# EasyEDA schematic SCH_New-Project-123_2026-03-22.json
TITLE: Sheet_1; REV: 1.0; Date: 2026-03-16; Sheet: 1/1; Drawn By: shyamsunder2009pc; Company: Your Company
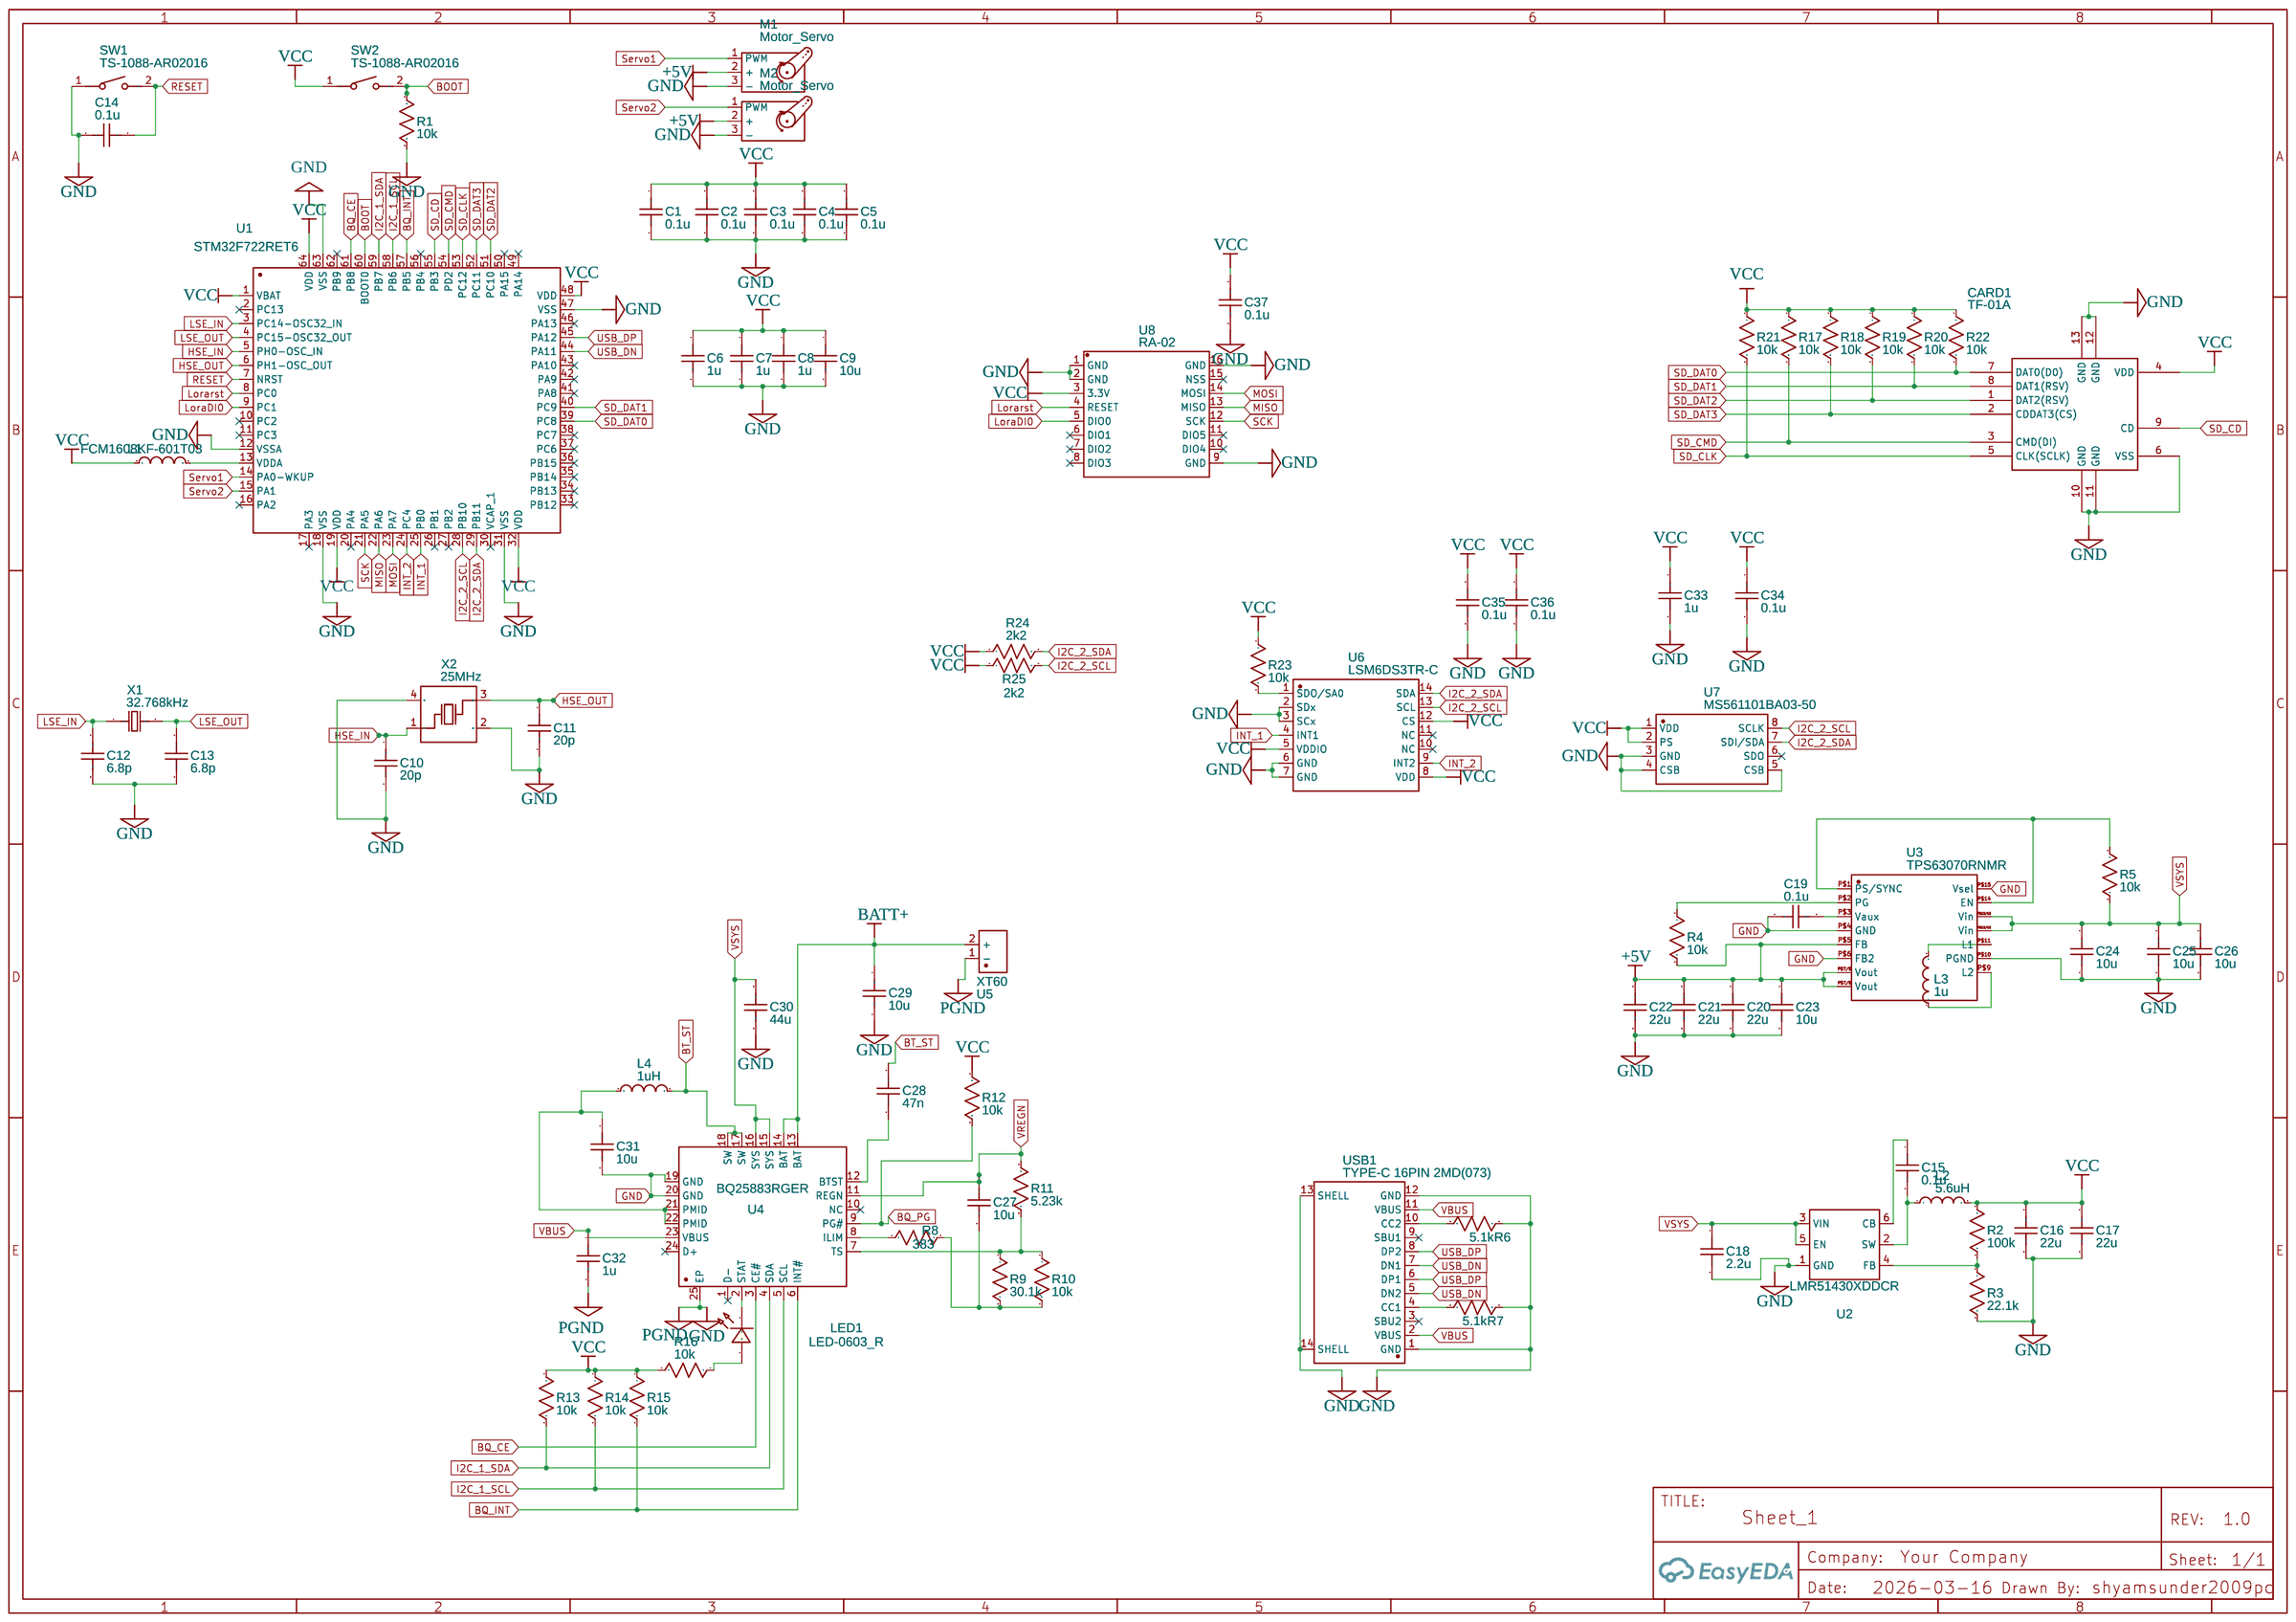
[diagram p0: schematic sheet]

## Parts
C1  0.1u  [C0603]
C2  0.1u  [C0603]
C3  0.1u  [C0603]
C4  0.1u  [C0603]
C5  0.1u  [C0603]
C6  1u  [C0603]
C7  1u  [C0603]
C8  1u  [C0603]
C9  10u  [C0805]
C10  20p  [C0603]
C11  20p  [C0603]
C12  6.8p  [C0603]
C13  6.8p  [C0603]
C14  0.1u  [C0603]
C15  0.1u  [C0603]
C16  22u  [C0805]
C17  22u  [C0805]
C18  2.2u  [C0603]
C19  0.1u  [C0603]
C20  22u  [C0805]
C21  22u  [C0805]
C22  22u  [C0805]
C23  10u  [C0805]
C24  10u  [C0805]
C25  10u  [C0805]
C26  10u  [C0805]
C27  10u  [C0805]
C28  47n  [C0603]
C29  10u  [C0805]
C30  44u  [C0805]
C31  10u  [C0805]
C32  1u  [C0603]
C33  1u  [C0603]
C34  0.1u  [C0603]
C35  0.1u  [C0603]
C36  0.1u  [C0603]
C37  0.1u  [C0603]
CARD1  TF-01A  [TF-SMD_TF-01A]
L1  FCM1608KF-601T03  [L0603]
L2  5.6uH  [IND-SMD_L3.0-W3.0]
L3  1u  [L0603]
L4  1uH  [L2520]
LED1  LED-0603_R  [LED0603_RED]
M1  Motor_Servo  [HDR-TH_PZ254V-11-03P-YL]
M2  Motor_Servo  [HDR-TH_PZ254V-11-03P-YL]
R1  10k  [R0603]
R2  100k  [R0603]
R3  22.1k  [R0603]
R4  10k  [R0603]
R5  10k  [R0603]
R6  5.1k  [R0603]
R7  5.1k  [R0603]
R8  383  [R0603]
R9  30.1k  [R0603]
R10  10k  [R0603]
R11  5.23k  [R0603]
R12  10k  [R0603]
R13  10k  [R0603]
R14  10k  [R0603]
R15  10k  [R0603]
R16  10k  [R0603]
R17  10k  [R0603]
R18  10k  [R0603]
R19  10k  [R0603]
R20  10k  [R0603]
R21  10k  [R0603]
R22  10k  [R0603]
R23  10k  [R0603]
R24  2k2  [R0603]
R25  2k2  [R0603]
SW1  TS-1088-AR02016  [SW-SMD_L3.9-W3.0-P4.45]
SW2  TS-1088-AR02016  [SW-SMD_L3.9-W3.0-P4.45]
U1  STM32F722RET6  [LQFP-64_L10.0-W10.0-P0.50-LS12.0-BL]
U2  LMR51430XDDCR  [SOT-23-6_L2.9-W1.6-P0.95-LS2.8-BL]
U3  TPS63070RNMR  [VQFN-15-HR(3X2.5)]
U4  BQ25883RGER  [VFQFPN-24_L4.0-W4.0-P0.50-BL-EP2.8]
U5  XT60  [CONN-TH_XT60]
U6  LSM6DS3TR-C  [LGA-14_L3.0-W2.5-P0.50-TL]
U7  MS561101BA03-50  [SENSORS-SMD_MS5611-01BA03]
U8  RA-02  [WIRELM-SMD_RA-02-BL]
USB1  TYPE-C 16PIN 2MD(073)  [USB-C-SMD_TYPE-C-6PIN-2MD-073]
X1  32.768kHz  [FC-135R_L3.2-W1.5]
X2  25MHz  [CRYSTAL-SMD_4P-L3.2-W2.5-BL]

## Library data of the parts
C1-C37 = C_0603_US: Contributor: LCEDA_Lib
CARD1 = TF-01A: Supplier: LCSC; Manufacturer: 韩国韩荣; Supplier Part: C91145; JLCPCB Part Class: Extended Part
L1 = FCM1608KF-601T03: Contributor: LCSC; Supplier: LCSC; Supplier Part: C141723; Manufacturer: TAI-TECH(台庆); JLCPCB Part Class: Extended Part
L2 = YHNR3015-5R6M: Supplier: LCSC; Supplier Part: C18236327; Manufacturer: YJYCOIN(益嘉源); Contributor: lcsc; JLCPCB Part Class: Extended Part
L3 = L0603_US: Contributor: LCEDA_Lib
L4 = DFE252012F-1R0M=P2: Contributor: LCSC; Supplier: LCSC; Supplier Part: C435392; Manufacturer: muRata(村田); JLCPCB Part Class: Extended Part
LED1 = LED-0603_R: Manufacturer: EVERLIGHT(台湾亿光); Manufacturer Part: 19-217/R6C-AL1M2VY/3T; Supplier Part: C72044; Supplier: LCSC; Contributor: LCEDA_01
M1 M2 = Motor_Servo: Contributor: KiCAD; license: https://www.gnu.org/licenses/lgpl-2.1.html
R1-R25 = R_0603_US: Contributor: LCEDA_Lib
SW1 SW2 = TS-1088-AR02016: Contributor: LCSC; Supplier: LCSC; Supplier Part: C720477; Manufacturer: XUNPU(讯普); JLCPCB Part Class: Basic Part
U1 = STM32F722RET6: Contributor: LCSC; Supplier: LCSC; Supplier Part: C118207; Manufacturer: ST(意法半导体); JLCPCB Part Class: Extended Part
U2 = LMR51430XDDCR: Contributor: lcsc; Supplier: LCSC; Supplier Part: C5185863; Manufacturer: TI(德州仪器); JLCPCB Part Class: Extended Part
U3 = TPS63070RNMR: Supplier: LCSC; Manufacturer: TI(德州仪器); Supplier Part: C109322; JLCPCB Part Class: Extended Part
U4 = BQ25883RGER: Contributor: LCSC; Supplier: LCSC; Supplier Part: C544362; Manufacturer: TI(德州仪器); JLCPCB Part Class: Extended Part
U5 = XT60: Contributor: lcsc; Supplier: LCSC; Supplier Part: C98733; Manufacturer: AMASS(艾迈斯); Manufacturer Part: XT60-M.; JLCPCB Part Class: Extended Part
U6 = LSM6DS3TR-C: Contributor: LCSC; Supplier: LCSC; Supplier Part: C967633; Manufacturer: ST(意法半导体); JLCPCB Part Class: Extended Part
U7 = MS561101BA03-50: Contributor: LCSC; Supplier: LCSC; Supplier Part: C15639; Manufacturer: TE Connectivity(泰科电子); JLCPCB Part Class: Extended Part
U8 = RA-02: Contributor: LCSC; Supplier: LCSC; Supplier Part: C90039; Manufacturer: Ai-Thinker(安信可); Manufacturer Part: Ra-02; JLCPCB Part Class: Extended Part
USB1 = TYPE-C 16PIN 2MD(073): Contributor: LCSC; Supplier: LCSC; Supplier Part: C2765186; Manufacturer: SHOU HAN(首韩); JLCPCB Part Class: Extended Part
X1 = Q13FC1350000400: Supplier: LCSC; Manufacturer Part: Q13FC13500004; Manufacturer: EPSON(爱普生); Supplier Part: C32346; JLCPCB Part Class: Basic Part
X2 = X322525MOB4SI: Supplier: LCSC; Manufacturer: YXC(扬兴晶振); Supplier Part: C9006; JLCPCB Part Class: Basic Part

## Nets
+5V: C20.1 C21.1 C22.1 C23.1 M1.2(+) M2.2(+) R4.2 U3.P$5(FB) U3.P$7/8(Vout)
GND: C1.2 C2.2 C3.2 C4.2 C5.2 C6.2 C7.2 C8.2 C9.2 C10.2 C11.2 C12.2 C13.2 C14.1 C16.2 C17.2 C18.2 C19.1 C20.2 C21.2 C22.2 C23.2 C24.2 C25.2 C26.2 C29.2 C30.2 C31.2 C32.2 C33.2 C34.2 C35.2 C36.2 C37.2 CARD1.6(VSS) CARD1.10(GND) CARD1.11(GND) CARD1.12(GND) CARD1.13(GND) M1.3(-) M2.3(-) R1.2 R3.2 R6.2 R7.2 SW1.1 U1.12(VSSA) U1.18(VSS) U1.31(VSS) U1.47(VSS) U1.63(VSS) U2.1(GND) U3.P$4(GND) U3.P$6(FB2) U3.P$10(PGND) U3.P$15(Vsel) U4.19(GND) U4.20(GND) U4.25(EP) U5.1(-) U6.2(SDx) U6.3(SCx) U6.6(GND) U6.7(GND) U7.3(GND) U7.4(CSB) U7.5(CSB) U8.1(GND) U8.2(GND) U8.9(GND) U8.16(GND) USB1.1(GND) USB1.12(GND) USB1.13(SHELL) USB1.14(SHELL) X2.2(GND) X2.4(GND)
VBUS: C32.1 U4.23(VBUS) USB1.2(VBUS) USB1.11(VBUS)
VCC: C1.1 C2.1 C3.1 C4.1 C5.1 C6.1 C7.1 C8.1 C9.1 C16.1 C17.1 C33.1 C34.1 C35.1 C36.1 C37.1 CARD1.4(VDD) L1.1 L2.2 R2.1 R12.1 R13.1 R14.1 R15.1 R16.2 R17.1 R18.1 R19.1 R20.1 R21.1 R22.1 R23.1 R24.1 R25.1 SW2.1 U1.1(VBAT) U1.19(VDD) U1.32(VDD) U1.48(VDD) U1.64(VDD) U6.5(VDDIO) U6.8(VDD) U6.12(CS) U7.1(VDD) U7.2(PS) U8.3(3.3V)
BATT+: C29.1 U4.13(BAT) U4.14(BAT) U5.2(+)
BOOT: R1.1 SW2.2 U1.60(BOOT0)
BQ_CE: U1.61(PB8) U4.3(CE#)
BQ_INT: R15.2 U1.57(PB5) U4.6(INT#)
BQ_PG: R12.2 U4.9(PG#)
BT_ST: C28.2 L4.2 U4.17(SW) U4.18(SW)
HSE_IN: C10.1 U1.5(PH0-OSC_IN) X2.1(OSC1)
HSE_OUT: C11.1 U1.6(PH1-OSC_OUT) X2.3(OSC2)
I2C_1_SCL: R14.2 U1.58(PB6) U4.5(SCL)
I2C_1_SDA: R13.2 U1.59(PB7) U4.4(SDA)
I2C_2_SCL: R25.2 U1.28(PB10) U6.13(SCL) U7.8(SCLK)
I2C_2_SDA: R24.2 U1.29(PB11) U6.14(SDA) U7.7(SDI/SDA)
INT_1: U1.25(PB0) U6.4(INT1)
INT_2: U1.24(PC4) U6.9(INT2)
LoraDI0: U1.9(PC1) U8.5(DIO0)
Lorarst: U1.8(PC0) U8.4(RESET)
LSE_IN: C12.1 U1.3(PC14-OSC32_IN) X1.1
LSE_OUT: C13.1 U1.4(PC15-OSC32_OUT) X1.2
MISO: U1.22(PA6) U8.13(MISO)
MOSI: U1.23(PA7) U8.14(MOSI)
RESET: C14.2 SW1.2 U1.7(NRST)
SCK: U1.21(PA5) U8.12(SCK)
SD_CD: CARD1.9(CD) U1.55(PB3)
SD_CLK: CARD1.5(CLK(SCLK)) R21.2 U1.53(PC12)
SD_CMD: CARD1.3(CMD(DI)) R17.2 U1.54(PD2)
SD_DAT0: CARD1.7(DAT0(D0)) R22.2 U1.39(PC8)
SD_DAT1: CARD1.8(DAT1(RSV)) R20.2 U1.40(PC9)
SD_DAT2: CARD1.1(DAT2(RSV)) R19.2 U1.51(PC10)
SD_DAT3: CARD1.2(CDDAT3(CS)) R18.2 U1.52(PC11)
Servo1: M1.1(PWM) U1.14(PA0-WKUP)
Servo2: M2.1(PWM) U1.15(PA1)
USB_DN: U1.44(PA11) USB1.5(DN2) USB1.7(DN1)
USB_DP: U1.45(PA12) USB1.6(DP1) USB1.8(DP2)
VREGN: C27.1 R11.1 U4.11(REGN)
VSYS: C18.1 C24.1 C25.1 C26.1 C30.1 R5.2 U2.3(VIN) U2.5(EN) U3.P$12/13(Vin) U4.15(SYS) U4.16(SYS)
Net-(C15-1): C15.1 U2.6(CB)
Net-(C15-2): C15.2 L2.1 U2.2(SW)
Net-(C19-2): C19.2 U3.P$3(Vaux)
Net-(C27-2): C27.2 R8.2 R9.2 R10.2
Net-(C28-1): C28.1 U4.12(BTST)
Net-(C31-1): C31.1 L4.1 U4.21(PMID) U4.22(PMID)
Net-(L1-2): L1.2 U1.13(VDDA)
Net-(L3-1): L3.1 U3.P$9(L2)
Net-(L3-2): L3.2 U3.P$11(L1)
Net-(LED1-1): LED1.1 R16.1
Net-(LED1-2): LED1.2 U4.2(STAT)
Net-(R2-2): R2.2 R3.1 U2.4(FB)
Net-(R4-1): R4.1 U3.P$2(PG)
Net-(R5-1): R5.1 U3.P$1(PS/SYNC) U3.P$14(EN)
Net-(R6-1): R6.1 USB1.10(CC2)
Net-(R7-1): R7.1 USB1.4(CC1)
Net-(R8-1): R8.1 U4.8(ILIM)
Net-(R9-1): R9.1 R10.1 R11.2 U4.7(TS)
Net-(R23-2): R23.2 U6.1(SDO/SA0)

Not connected (* = marked no-connect by the designer): U1 2(PC13)* 10(PC2)* 11(PC3)* 16(PA2)* 17(PA3)* 20(PA4)* 26(PB1)* 27(PB2)* 30(VCAP_1)* 33(PB12)* 34(PB13)* 35(PB14)* 36(PB15)* 37(PC6)* 38(PC7)* 41(PA8)* 42(PA9)* 43(PA10)* 46(PA13)* 49(PA14)* 50(PA15)* 56(PB4)* 62(PB9)*; U4 1(D-)* 10(NC)* 24(D+)*; U6 10(NC)* 11(NC)*; U7 6(SDO)*; U8 6(DIO1)* 7(DIO2)* 8(DIO3)* 10(DIO4)* 11(DIO5)* 15(NSS)*; USB1 3(SBU2)* 9(SBU1)*
